# Altium schematic sheet 04_Power.SchDoc
size A; SheetNumber: 3; SheetTotal: 5
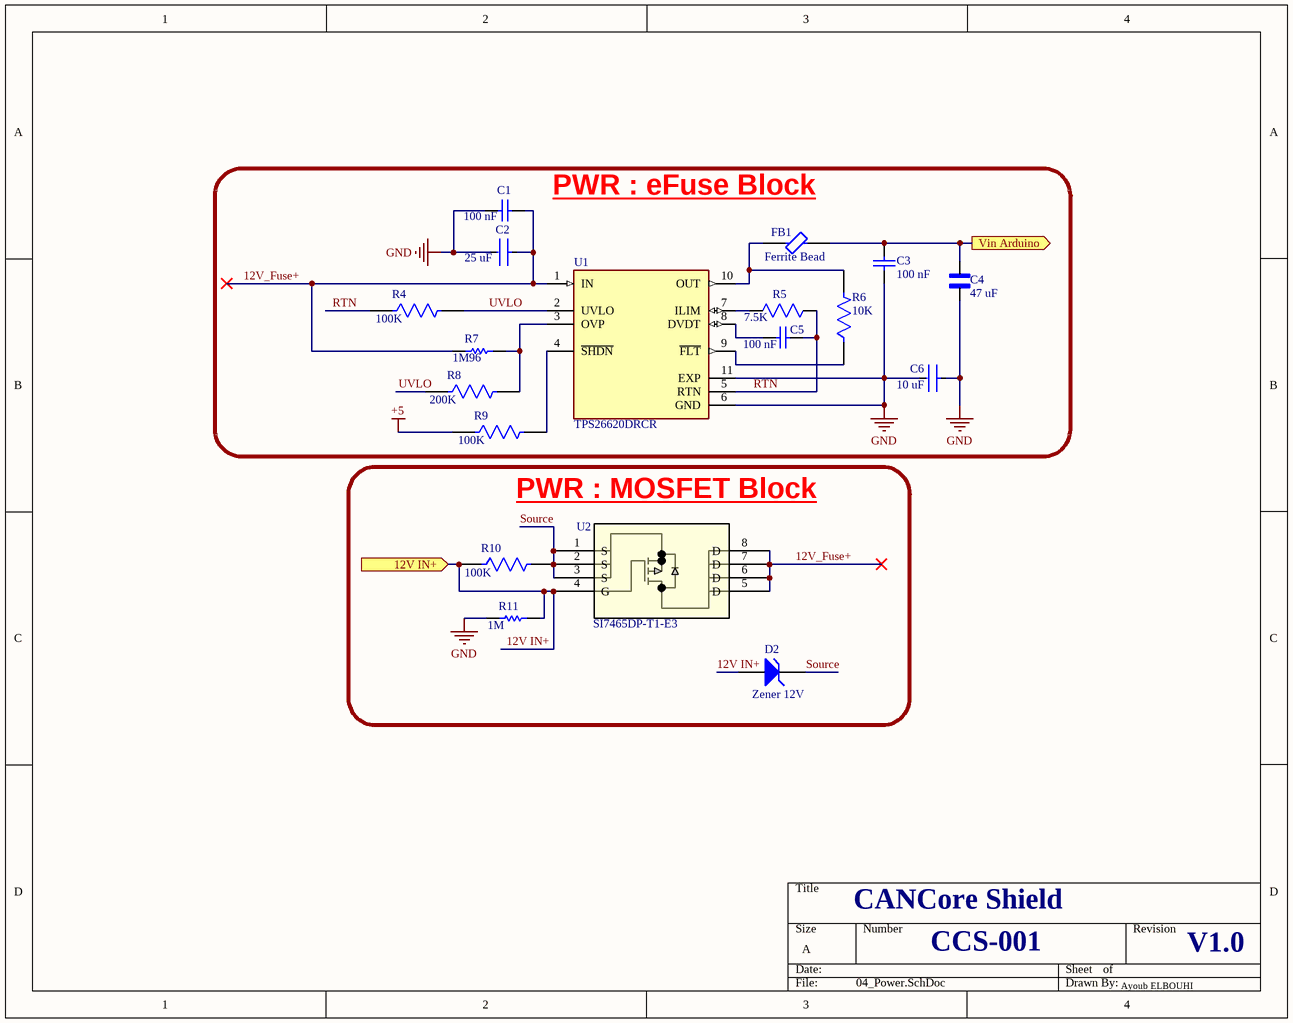
[diagram p0: 04_Power.SchDoc]

## Parts
C1  100 nF  [CAPC1608X90X35ML10T15]
C2  25 uF  [FP-GRM32-MFG]
C3  100 nF  [CAPC1608X90X35ML10T15]
C4  47 uF  [CAPC3225X270N]
C5  100 nF  [CAPC1608X90X35ML10T15]
C6  10 uF  [FP-GCM188-0_1-IPC_C]
D2  Zener 12V  [DIOD-SOD123-2_V]
FB1  Ferrite Bead  [FP-BLM21-0_2-t0_85-e0_5-IPC_C]
R4  100K  [FP-RC0603-0_55-MFG]
R5  7.5K  [RESC1608X60N]
R6  10K  [FP-RC0603-0_55-MFG]
R7  1M96  [RESC0603(1608)_L]
R8  200K  [FP-RC0603-0_55-IPC_B]
R9  100K  [FP-RC0603-0_55-MFG]
R10  100K  [FP-RC0603-0_55-MFG]
R11  1M  [RESC1608X55X25ML10T15]
U1  TPS26620DRCR  [IC_TPS26620DRCR]
U2  SI7465DP-T1-E3  [PowerPAK_SO-8_VIS]

## Blocks framed on the sheet
PWR : eFuse Block: C1-C6 FB1 R4-R9 U1
PWR : MOSFET Block: D2 R10 R11 U2

## Ports
12V IN+ (in), Vin Arduino (out)

## Nets
+5: R9.1
GND: C1.1 C2.2 C3.2 C4.1 C6.1 C6.2 R11.1 U1.6(GND) U1.11(EXP)
12V IN+: D2.1(A) R10.1 R11.2 U2.4(G) ; port 12V IN+
12V_Fuse+: C1.2 C2.1 R7.2 U1.1(IN) U2.5(D) U2.6(D) U2.7(D) U2.8(D)
RTN: C5.2 R4.1 R5.1(R1) U1.5(RTN)
Source: D2.2(K) R10.2 U2.1(S) U2.2(S) U2.3(S)
UVLO: R4.2 R8.1 U1.2(UVLO)
Vin Arduino: C3.1 C4.2 FB1.2 ; port Vin Arduino
NetC5_1: C5.1 U1.8(DVDT)
NetFB1_1: FB1.1 R6.2 U1.10(OUT)
NetR5_2: R5.2(R2) U1.7(ILIM)
NetR6_1: R6.1 U1.9(~{FLT})
NetR7_1: R7.1 R8.2 U1.3(OVP)
NetR9_2: R9.2 U1.4(~{SHDN})

## Notes on the sheet
- CANCore Shield
- CCS-001
- V1.0
- Ayoub ELBOUHI

## Library data of the parts
C1 C3 C5 = CMP-2100-03643-1: Chip Capacitor, 0.1 uF, +/- 10%, 50 V, -55 to 125 degC, 0603 (1608 Metric), RoHS, Tape and Reel; Manufacturer: Murata; Dielectric Material: Ceramic; Voltage Rating: 50V; Capacitance: 100nF; Dielectric: X7R; Insulation Resistance: 10GR; Case Code (Metric): 1608; Lead Free: LeadFree; Depth: 0.8mm; Number of Pins: 2; Radiation Hardening: No; Case/Package: 0603; Manufacturer URL: http://www.murata.com/; Packaging: TapeandReel; Length: 1.6mm; Contact Plating: Tin; Datasheet URL: http://psearch.en.murata.com/capacitor/product/GRM188R71H104KA93%23.pdf; Tolerance: 10%; Case Code (Imperial): 0603; Min Operating Temperature: -55degC; RoHSCompliant: true; Voltage: 50V; Termination: SMD/SMT; Mount: SurfaceMount; Material: Ceramic; Package Quantity: 1; Height: 0.8mm; Thickness: 0.035inch; REACH SVHC: NoSVHC; Max Operating Temperature: 125degC; Width: 0.8mm; Package Reference: 0603; Voltage Rating (DC): 50V; Datasheet Version: 42675.0; Package Description: 2-Pin Surface Mount Device, Body 1.6 x 0.8 mm
C2 = CMP-2000-05261-2: CAP CER 10UF 50V X7R 1210; Manufacturer Part Number: GRM32ER71H106KA12L; Manufacturer: Murata; Tolerance: 10%; Material: Ceramic; Temperature Coefficient: 15%; Voltage Rating: 50V; Temperature Characteristic: X7R; Value: 10uF; ComponentLink2Description: Datasheet; Device Class L1: Passive Components; Lead Free: Yes; Temperature Range High: +125°C; Category: Cap; ComponentLink2URL: https://search.murata.co.jp/Ceramy/image/img/A01X/G101/ENG/GRM32ER71H106KA12-01.pdf; Device Class L2: Capacitors; Package: GRM32; Mouser Description: 1210 10 uF 50 V ±10% Tolerance X7R SMT Multilayer Ceramic Capacitor; Capacitance: 10uF; Octopart: https://octopart.com/grm32er71h106ka12l-murata-10470987; Digikey Description: CAP CER 10UF 50V X7R 1210; Height: 2.7mm; Temperature: -55°C to +125°C; Temperature Range Low: -55°C; RoHS: TRUE; Device Class L3: Ceramic Capacitors; Automotive: No
C4 = GRM32ER71A476KE15L: SMD capacitor X7R(EIA) with capacitance 47uF Tol.10%. Rated voltage 10Vdc 125C; MF: Murata Electronics; SnapEDA_Link: https://www.snapeda.com/parts/GRM32ER71A476KE15L/Murata+Electronics+North+America/view-part/?ref=snap; Package: 3225 Murata; Value: *; MP: GRM32ER71A476KE15L; Check_prices: https://www.snapeda.com/parts/GRM32ER71A476KE15L/Murata+Electronics+North+America/view-part/?ref=eda
C6 = CMP-06035-046689-1: Ceramic Capacitor for Automotive 91pF  ±1% 100VDC X8G 0603 Paper T/R
D2 = CMP-0734-00002-2: Surface Mount Zener Diode, 12 V, 2-Pin 2.7 x 1.55 x 1.45 mm SOD123, -65 to 125 degC, RoHS, Tape and Reel; PartNumber: BZT52C12-7-F; Manufacturer: Diodes Inc; Power Rating: 500 mW; Maximum Zener Impedance f: 1kHz ZZT=25 Ohm; Zener Voltage Range: 11.4 to 12.7 V; Maximum Reverse Current: 0.1 uA; PackageDescription: 2-Pin SOD123, Body 2.7 x 1.55 mm, Height 1.45 mm; DatasheetVersion: Rev. 37 - 2; ComponentLink1URL: http://www.diodes.com/; Mounting Technology: Surface Mount; ComponentLink3URL: http://www.diodes.com/datasheets/ds18004.pdf; ComponentLink3Description: Package Specification; ComponentLink1Description: Manufacturer URL; Packing: Tape and Reel; PackageReference: SOD123-2; PackageVersion: Rev. 37 - 2; ComponentLink2Description: Datasheet; ComponentLink2URL: http://www.diodes.com/datasheets/ds18004.pdf; Operating Temperature Range: -65 to 150 degC; RoHS: TRUE
FB1 = CMP-0686-00682-3: Chip Ferrite Bead, 0805, 600Ω @ 100MHz, 0.35Ω, 25%, 300mA; DC Resistance (DCR): 350mR; Impedance: 600R; Max DC Current: 200mA; Number of Circuits: 1; Material: Steel; Shielding: Unshielded; Series: BLM21B; Military Standard: Not; Test Frequency: 100MHz; RoHS Compliant: Yes; Depth: 1.25mm; DC Resistance-Max: 350mR; Case/Package: 0805; Lead Free: Lead Free; Number of Pins: 2; Height: 0.85mm; DC Current: 200mA; Case Code (Metric): 2012; Package Quantity: 1; Packaging: Tape and Reel; Current Rating: 200mA; Max Current Rating: 300mA; Max Operating Temperature: 125°C; Termination: SMD/SMT; Case Code (Imperial): 0805; Tolerance: 25%; REACH SVHC: No SVHC; Frequency: 100MHz; Width: 1.25mm; Min Operating Temperature: -55°C; Radiation Hardening: No; Core Material: Ferrite; Contact Plating: Tin; Number of Lines: 1; Length: 2mm
R4 R9 R10 = CMP-2100-03662-2: RES SMD 100K OHM 1% 1/10W 0603; Voltage Rating (DC): 50V; Resistance: 100kR; Max Power Dissipation: 100mW; Temperature Coefficient: 100ppm/°C; Working Voltage: 75V; Length: 1.6mm; Lead Free: Lead Free; Number of Terminations: 2; Packaging: Tape and Reel; Voltage Rating: 50V; Termination: SMD/SMT; Width: 0.8mm; Resistor Type: Thick Film; Resistance Tolerance: 1%; Features: Moisture Resistant; Height: 0.45mm; Construction: Rectangular; Case/Package: 0603; Military Standard: Not; Case Code (Imperial): 0603; Series: RC; Technology: THICK FILM; Depth: 0.8mm; RoHS Compliant: Yes; REACH SVHC: No SVHC; Min Operating Temperature: -55°C; Case Code (Metric): 1608; Max Operating Temperature: 155°C; Power Rating: 100mW; Number of Pins: 2; Tolerance: 1%
R5 = RC0603FR-077K5L: 7.5 kOhms Â±1% 0.1W, 1/10W Chip Resistor 0603 (1608 Metric) Moisture Resistant Thick Film; MF: Yageo; SnapEDA_Link: https://www.snapeda.com/parts/RC0603FR-077K5L/Yageo/view-part/?ref=snap; Package: 0603 Yageo; Value: *; MP: RC0603FR-077K5L; Check_prices: https://www.snapeda.com/parts/RC0603FR-077K5L/Yageo/view-part/?ref=eda
R6 = CMP-2100-03664-2: RES 10K OHM 1% 1/10W 0603; Voltage Rating: 75V; Voltage Rating (DC): 50V; Resistance: 10kR; Power Rating: 100mW; Temperature Coefficient: 100ppm/°C; Depth: 0.8mm; Termination: SMD/SMT; Resistor Type: Thick Film; Series: RC; Construction: Rectangular; Features: Moisture Resistant; Packaging: Tape and Reel; Min Operating Temperature: -55°C; Number of Terminations: 2; Lead Pitch: 0.3mm; RoHS Compliant: Yes; Case/Package: 0603; Resistance Tolerance: 1%; Military Standard: Not; Weight: 7.1E-05oz; Number of Pins: 2; Tolerance: 1%; Length: 1.6mm; Case Code (Imperial): 0603; Lead Free: Lead Free; Width: 0.8mm; Max Power Dissipation: 100mW; Height: 0.45mm; Max Operating Temperature: 155°C; Case Code (Metric): 1608; Size Code: 0603
R7 = CMP-1012-00880-1: 1M96 0.1W 1% 0603 (1608 Metric)  SMD; Case-Metric: 1608; Case-EIA: 0603; Value: 1960000.00 Ohm; Power: 0.1 W; Tolerance: 1 %; Technology: SMT
R8 = CMP-03412-037786-1: RES SMD 200K OHM 1% 1/10W 0603; Temperature Coefficient: 100ppm/°C; Voltage Rating: 50V; Resistance: 200kR; Max Power Dissipation: 100mW; Packaging: Tape and Reel; REACH SVHC: No SVHC; Resistance Tolerance: 1%; Number of Pins: 2; Width: 0.031inch; Termination: SMD/SMT; Features: Moisture Resistant; Tolerance: 1%; Series: RC; Case Code (Imperial): 0603; Depth: 0.8mm; Number of Terminations: 2; Max Operating Temperature: 155°C; Resistor Type: Thick Film; Height: 0.022inch; Lead Free: Lead Free; Construction: Rectangular; Case/Package: 0603; Power Rating: 100mW; Case Code (Metric): 1608; Length: 1.6mm; Size Code: 0603; RoHS Compliant: Yes; Military Standard: Not; Min Operating Temperature: -55°C; Package Quantity: 1; Voltage Rating (DC): 50V
R11 = CMP-1659-00056-1: Chip Resistor, 1 MOhm, +/- 1%, 100 mW, -55 to 155 degC, 0603 (1608 Metric), RoHS, Tape and Reel; Voltage Rating (DC): 25 V; Tolerance: 20%; Case\Package: Radial; Capacitance: 1 mF; Min Operating Temperature: -40 degC; PackageDescription: 2-Pin Surface Mount Device, Body 1.6 x 0.8 mm; ComponentLink1Description: Manufacturer URL; Radiation Hardening: No; DatasheetVersion: Rev. 4, 02/2016; REACH SVHC: No SVHC; Length: 20 mm; Max Operating Temperature: 85 degC; Diameter: 10 mm; Packaging: Bulk; Package Quantity: 200; PackageReference: 0603; Mount: Through Hole; ComponentLink1URL: http://www.yageo.com/; ComponentLink2URL: http://www.yageo.com/documents/recent/PYu-RC_Group_51_RoHS_L_04.pdf; ComponentLink2Description: Datasheet; Width: 0 inch; Lead Pitch: 5 mm; RoHSCompliant: true; Voltage Rating: 25 V; Height: 20 mm
U1 = TPS26620DRCR: MF: {'manufacturer': u'Texas Instruments'}; Package: None; Price: None; Value: *; MP: TPS26620DRCR; Availability: Unavailable
U2 = SI7465DP-T1-E3: P-CHANNEL 60-V (D-S) MOSFET; Manufacturer_Name: Vishay; Copyright: Copyright (C) 2026 Ultra Librarian. All rights reserved.; Manufacturer_Part_Number: SI7465DP-T1-E3; RefDes: RefDes; Type: Type